# Altium schematic sheet LCD&SDcard.SchDoc: LCD & SD Card
size A4; Date: Not used; ApprovedBy: Not used; CheckedBy: Not used; Author: Not used; CompanyName: STMicroelectronics; DrawnBy: Not used; Engineer: Not used; Organization: Not used; Address1: Not used; Address2: Not used; Address3: Not used; Address4: Not used; DocumentNumber: Not used; Revision: Not used; SheetNumber: 10; SheetTotal: 22; CurrentTime: Not used; CurrentDate: Not used; Time: Not used; DocumentFullPathAndName: Not used; DocumentName: Not used; ModifiedDate: Not used; ImagePath: Not used; ProjectName: Not used; Application_BuildNumber: Not used
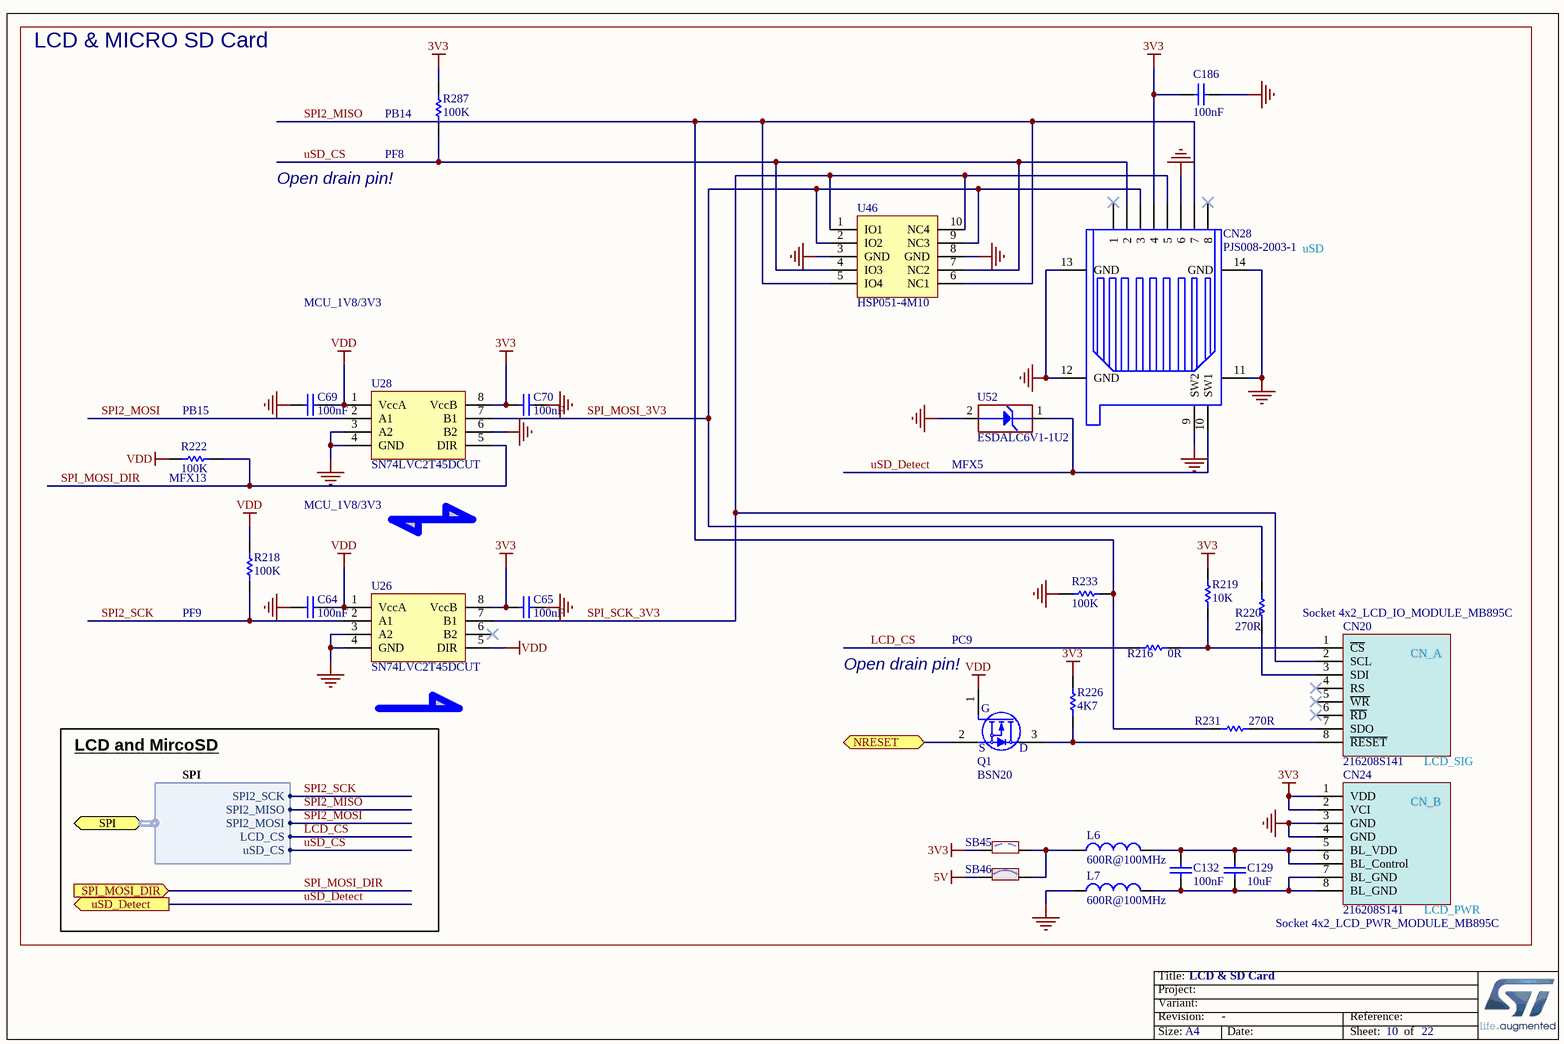
[diagram p0: LCD&SDcard.SchDoc]

## Parts
C64  value 100nF  [C0603]  (hidden comment: Capacitor)
C65  value 100nF  [C0603]  (hidden comment: Capacitor)
C69  value 100nF  [C0603]  (hidden comment: Capacitor)
C70  value 100nF  [C0603]  (hidden comment: Capacitor)
C129  value 10uF  [C0805]  (hidden comment: Capacitor)
C132  value 100nF  [C0402]  (hidden comment: Capacitor)
C186  value 100nF  [C0402]  (hidden comment: Capacitor)
CN20  Socket 4x2_LCD_IO_MODULE_MB895C  value 216208S141  [CON_SOCKET-LCD_LYCN_216208S141]
CN24  Socket 4x2_LCD_PWR_MODULE_MB895C  value 216208S141  [CON_SOCKET-LCD_LYCN_216208S141]
CN28  value PJS008-2003-1  [CON_MICROSD_YAMAICHI_PJS008-2003-1]  (hidden comment: microSD-PJS008-2003)
L6  value 600R@100MHz  [L0603]  (hidden comment: BEAD)
L7  value 600R@100MHz  [L0603]  (hidden comment: BEAD)
Q1  BSN20  [MOS_SOT23]
R216  value 0R  [R0603]  (hidden comment: Resistor)
R218  value 100K  [R0603]  (hidden comment: Resistor)
R219  value 10K  [R0603]  (hidden comment: Resistor)
R220  value 270R  [R0603]  (hidden comment: Resistor)
R222  value 100K  [R0603]  (hidden comment: Resistor)
R226  value 4K7  [R0402]  (hidden comment: Resistor)
R231  value 270R  [R0603]  (hidden comment: Resistor)
R233  value 100K  [R0603]  (hidden comment: Resistor)
R287  value 100K  [R0603]  (hidden comment: Resistor)
SB45  SB_OFF  [SOLDER-BRIDGE_R0603-0R]  (value not drawn)
SB46  SB_ON  [SOLDER-BRIDGE_R0603-0R]  (value not drawn)
U26  SN74LVC2T45DCUT  [ICC_VSSOP8_DCU_R-PDSO-G8_2X2P30_P050]
U28  SN74LVC2T45DCUT  [ICC_VSSOP8_DCU_R-PDSO-G8_2X2P30_P050]
U46  HSP051-4M10  [ESD_UQFN-10L_2P5X1_P050]
U52  value ESDALC6V1-1U2  [ESD_ST0201]  (hidden comment: ESD-TRANSIL)

## Ports
NRESET, SPI (harness SPI), SPI_MOSI_DIR (in), uSD_Detect (out)

## Harnesses
SPI: SPI2_SCK, SPI2_MISO, SPI2_MOSI, LCD_CS, uSD_CS

## Nets
3V3: C65.2 C70.2 C186.1 CN24.1(VDD) CN24.2(VCI) CN28.4 R219.2 R226.1 R287.2 SB45.1 U26.8(VccB) U28.8(VccB)
5V: SB46.1
GND: C64.2 C65.1 C69.2 C70.1 C186.2 CN24.3(GND) CN24.4(GND) CN28.6 CN28.9(SW2) CN28.11(GND) CN28.12(GND) CN28.13(GND) CN28.14(GND) L7.1 R233.2 U26.3(A2) U26.4(GND) U28.3(A2) U28.4(GND) U28.6(B2) U46.3(GND) U46.8(GND) U52.2(GND)
VDD: C64.1 C69.1 Q1.1(G) R218.2 R222.2 U26.1(VccA) U26.5(DIR) U28.1(VccA)
LCD_CS: R216.1 ; port SPI.LCD_CS
NRESET: Q1.2(S) ; port NRESET
SPI2_MISO: CN28.7 R231.1 R233.1 U46.5(IO4) U46.6(NC1) ; port SPI.SPI2_MISO
SPI2_MOSI: U28.2(A1) ; port SPI.SPI2_MOSI
SPI2_SCK: R218.1 U26.2(A1) ; port SPI.SPI2_SCK
SPI_MOSI_3V3: CN28.3 R220.1 U28.7(B1) U46.2(IO2) U46.9(NC3)
SPI_MOSI_DIR: R222.1 U28.5(DIR) ; port SPI_MOSI_DIR
SPI_SCK_3V3: CN20.2(SCL) CN28.5 U26.7(B1) U46.1(IO1) U46.10(NC4)
uSD_CS: CN28.2 R287.1 U46.4(IO3) U46.7(NC2) ; port SPI.uSD_CS
uSD_Detect: CN28.10(SW1) U52.1(IO1) ; port uSD_Detect
NetC129_1: C129.1 C132.2 CN24.5(BL_VDD) CN24.6(BL_Control) L6.2
NetC129_2: C129.2 C132.1 CN24.7(BL_GND) CN24.8(BL_GND) L7.2
NetCN20_1: CN20.1(~{CS}) R216.2 R219.1
NetCN20_3: CN20.3(SDI) R220.2
NetCN20_7: CN20.7(SDO) R231.2
NetCN20_8: CN20.8(~{RESET}) Q1.3(D) R226.2
NetL6_1: L6.1 SB45.2 SB46.2

Not connected (* = marked no-connect by the designer): CN20 4(RS)* 5(~{WR})* 6(~{RD})*; CN28 1* 8*; U26 6(B2)*

## Notes on the sheet
- LCD & MICRO SD Card
- (near R287) PB14
- Open drain pin!
- (near R287) PF8
- uSD
- MCU_1V8/3V3
- (near R222) PB15
- (near R222) MFX13
- (near U52) MFX5
- PF9
- PC9
- (near Q1) Open drain pin!
- LCD and MircoSD
- LCD_SIG
- LCD_PWR
- Title:
- Project:
- Size:
- Revision:
- Variant:
- A4
- -
- Date:
- Reference:
- Sheet:
- of
- (in symbol MCD-01174) CN_A
- (in symbol MCD-01195) CN_B

## Library data of the parts
C64 C65 C69 C70 = MCD-00211: Capacitor, MLCC, 100nF, 16V, X7R, 10%, 0603, T=0,8mm; Manufacturer_Part_Number: CC0603KRX7R7BB104; Manufacturer: YAGEO; Provided_By: SUBCO; Initial_Board_Reference: MB1319; Path: ws/MCD_ApplicationBoards/Lists/MCDPARTSdatabase; Item Type: Item; Internal_Part_Number: MCD-00211; ComponentLink1Description: Datasheet; Status: Released; Part_Type: Capacitor; Package: C0603; ComponentLink1URL: http://tunmcdsvn.tun.st.com/Component_Datasheet_Library/Trunk/Capacitors/Yageo_Multilayer_Capacitor_X7R_series_100pF_to_22uF
C129 = MCD-00014: Capacitor, MLCC, 10uF, 25V, X5R, 10%, 0805, T=0,85mm; Manufacturer_Part_Number: CC0805KRX5R8BB106; Manufacturer: YAGEO; Provided_By: SUBCO; Initial_Board_Reference: MB1274; Path: ws/MCD_ApplicationBoards/Lists/MCDPARTSdatabase; Item Type: Item; Internal_Part_Number: MCD-00014; Status: Released; Part_Type: Capacitor; Package: C0805; ComponentLink1Description: Datasheet; ComponentLink1URL: http://tunmcdsvn.tun.st.com/Component_Datasheet_Library/Trunk/Capacitors/Yageo_Multilayer_capacitor_X5R_series_100pF_to_100uF
C132 C186 = MCD-00006: Capacitor, MLCC, 100nF, 16V, X7R, 10%, 0402, T=0.5mm; Manufacturer_Part_Number: CC0402KRX7R7BB104; Manufacturer: YAGEO; Alternate_Manufacturer_Part_Number: GCM155R71C104KA55D; Alternate_Manufacturer: MURATA; Provided_By: SUBCO; Initial_Board_Reference: MB1274; Path: ws/MCD_ApplicationBoards/Lists/MCDPARTSdatabase; Item Type: Item; Internal_Part_Number: MCD-00006; Status: Released; Part_Type: Capacitor; Package: C0402; ComponentLink1Description: Datasheet; ComponentLink1URL: http://tunmcdsvn.tun.st.com/Component_Datasheet_Library/Trunk/Capacitors/Yageo_Multilayer_Capacitor_X7R_series_100pF_to_22uF
CN20 = MCD-01174: Socket, 4x2, 2.54mm, VR, TH, Height 6.8mm, Double row; Part_Type: Connector; Manufacturer: LYCN; Provided_By: SUBCO; Initial_Board_Reference: MB1397; Path: ws/MCD_ApplicationBoards/Lists/MCDPARTSdatabase; Item Type: Item; Internal_Part_Number: MCD-01174; Status: Checked; Manufacturer_Part_Number: 216208S141; ComponentLink1Description: Datasheet; ComponentLink1URL: http://tunmcdsvn.tun.st.com/Component_Datasheet_Library/Trunk/Connectors/LYCN_216208S141
CN24 = MCD-01195: socket, 4x2, 2.54mm, VR, TH, Height 6.8mm, Double row; Part_Type: Connector; Manufacturer: LYCN; Provided_By: SUBCO; Initial_Board_Reference: MB1397; Remark: same footprint as MCD-01174; Path: ws/MCD_ApplicationBoards/Lists/MCDPARTSdatabase; Item Type: Item; Internal_Part_Number: MCD-01195; Status: Checked; Manufacturer_Part_Number: 216208S141; ComponentLink1Description: Datasheet; ComponentLink1URL: http://tunmcdsvn.tun.st.com/Component_Datasheet_Library/Trunk/Connectors/LYCN_216208S141
CN28 = MCD-00023: MicroSD Card Conn, Reversed-Type, Mnt Push-Push, Positionning holes; Manufacturer: YAMAICHI; Part_Type: Connector; Provided_By: SUBCO; Initial_Board_Reference: MB1274; Path: ws/MCD_ApplicationBoards/Lists/MCDPARTSdatabase; Item Type: Item; Internal_Part_Number: MCD-00023; Manufacturer_Part_Number: PJS008-2003-1; ComponentLink1Description: Datasheet; Status: Released; ComponentLink1URL: http://tunmcdsvn.tun.st.com/Component_Datasheet_Library/Trunk/Connectors/Yamaichi_Connector_microSD-Card-PJS008-2003
L6 L7 = MCD-00047: SMD Chip ferrite bead, 600R@100MHz +/-25%, 350mA, 500mohm DC, 0603, T=0.8mm; Part_Type: Inductor; Manufacturer_Part_Number: FCM1608KF-601T03; Manufacturer: TAI-TECH; Provided_By: SUBCO; Initial_Board_Reference: MB1274; Path: ws/MCD_ApplicationBoards/Lists/MCDPARTSdatabase; Item Type: Item; Internal_Part_Number: MCD-00047; Status: Released; ComponentLink1Description: Datasheet; ComponentLink1URL: http://tunmcdsvn.tun.st.com/Component_Datasheet_Library/Trunk/Inductors/TaiTech_Bead_FCM1608_series
Q1 = MCD-00151: N-channel enhancement mode field-effect transistor; Part_Type: IC; Manufacturer: NXP; Provided_By: SUBCO; Initial_Board_Reference: MB1262; Path: ws/MCD_ApplicationBoards/Lists/MCDPARTSdatabase; Item Type: Item; Internal_Part_Number: MCD-00151; Value: BSN20; Status: Released; Manufacturer_Part_Number: BSN20; ComponentLink1Description: Datasheet; ComponentLink1URL: http://tunmcdsvn.tun.st.com/Component_Datasheet_Library/Trunk/IC/NXP_Transistor_BSN20BK_SOT23
R216 = MCD-00056: Resistor,0R,0603,5%,1/10W; Manufacturer_Part_Number: RC0603JR-070RL; Manufacturer: YAGEO; Provided_By: SUBCO; Initial_Board_Reference: MB1274; Path: ws/MCD_ApplicationBoards/Lists/MCDPARTSdatabase; Item Type: Item; Internal_Part_Number: MCD-00056; Status: Released; Part_Type: Resistor; Package: R0603; ComponentLink1Description: Datasheet; ComponentLink1URL: http://tunmcdsvn.tun.st.com/Component_Datasheet_Library/Trunk/Resistors/Yageo_Resistor_RC0603-series
R218 R222 R233 R287 = MCD-00223: Resistor,100K,0603,1%,1/10W; Manufacturer_Part_Number: RC0603FR-07100KL; Manufacturer: YAGEO; Provided_By: SUBCO; Initial_Board_Reference: MB1319; Path: ws/MCD_ApplicationBoards/Lists/MCDPARTSdatabase; Item Type: Item; Internal_Part_Number: MCD-00223; Status: Released; Part_Type: Resistor; Package: R0603; ComponentLink1Description: Datasheet; ComponentLink1URL: http://tunmcdsvn.tun.st.com/Component_Datasheet_Library/Trunk/Resistors/Yageo_Resistor_RC0603-series
R219 = MCD-00220: Resistor,10K,0603,1%,1/10W; Manufacturer_Part_Number: RC0603FR-0710KL; Manufacturer: YAGEO; Provided_By: SUBCO; Initial_Board_Reference: MB1319; Path: ws/MCD_ApplicationBoards/Lists/MCDPARTSdatabase; Item Type: Item; Internal_Part_Number: MCD-00220; Status: Released; Part_Type: Resistor; Package: R0603; ComponentLink1Description: Datasheet; ComponentLink1URL: http://tunmcdsvn.tun.st.com/Component_Datasheet_Library/Trunk/Resistors/Yageo_Resistor_RC0603-series
R220 R231 = MCD-00442: Resistor,270R,0603,1%,1/10W; Manufacturer_Part_Number: RC0603FR-07270RL; Manufacturer: YAGEO; Provided_By: SUBCO; Initial_Board_Reference: MBxxxx; Path: ws/MCD_ApplicationBoards/Lists/MCDPARTSdatabase; Item Type: Item; Internal_Part_Number: MCD-00442; Status: Released; Part_Type: Resistor; Package: R0603; ComponentLink1Description: Datasheet; ComponentLink1URL: http://tunmcdsvn.tun.st.com/Component_Datasheet_Library/Trunk/Resistors/Yageo_Resistor_RC0603-series
R226 = MCD-00065: Resistor,4K7,0402,1%,1/16W; Manufacturer_Part_Number: RC0402FR-074K7L; Manufacturer: YAGEO; Alternate_Manufacturer_Part_Number: RT0402FRE074K7L; Provided_By: SUBCO; Initial_Board_Reference: MB1274; Path: ws/MCD_ApplicationBoards/Lists/MCDPARTSdatabase; Item Type: Item; Internal_Part_Number: MCD-00065; Status: Released; Part_Type: Resistor; Package: R0402; ComponentLink1Description: Datasheet; ComponentLink1URL: http://tunmcdsvn.tun.st.com/Component_Datasheet_Library/Trunk/Resistors/Yageo_Resistor_RC0402-series; Alternate_Manufacturer: YAGEO
SB45 = MCD-00072: Solder Bridge OFF; Part_Type: Mechanical; Manufacturer_Part_Number: RC0603JR-070RL; Manufacturer: YAGEO; Provided_By: SUBCO; Initial_Board_Reference: MB1274; Path: ws/MCD_ApplicationBoards/Lists/MCDPARTSdatabase; Item Type: Item; Internal_Part_Number: MCD-00072; Status: Released; ComponentLink1Description: Datasheet; Package: SB0603; ComponentLink1URL: http://tunmcdsvn.tun.st.com/Component_Datasheet_Library/Trunk/Resistors/Yageo_Resistor_RC0603-series
SB46 = MCD-00071: Solder Bridge ON; Part_Type: Mechanical; Manufacturer_Part_Number: RC0603JR-070RL; Manufacturer: YAGEO; Provided_By: SUBCO; Initial_Board_Reference: MB1274; Path: ws/MCD_ApplicationBoards/Lists/MCDPARTSdatabase; Item Type: Item; Internal_Part_Number: MCD-00071; Status: Released; ComponentLink1Description: Datasheet; Package: SB0603; ComponentLink1URL: http://tunmcdsvn.tun.st.com/Component_Datasheet_Library/Trunk/Resistors/Yageo_Resistor_RC0603-series
U26 U28 = MCD-00264: Dual bit dual supply bus transceiver; Part_Type: IC; Manufacturer: TEXAS INSTRUMENTS; Provided_By: SUBCO; Initial_Board_Reference: MB1319; Path: ws/MCD_ApplicationBoards/Lists/MCDPARTSdatabase; Item Type: Item; Internal_Part_Number: MCD-00264; Value: SN74LVC2T45DCUT; Status: Released; Manufacturer_Part_Number: SN74LVC2T45DCUT; ComponentLink1Description: Datasheet; ComponentLink1URL: http://tunmcdsvn.tun.st.com/Component_Datasheet_Library/Trunk/IC/TI_Dual_bit_tranceiver_SN74LVC2T45
U46 = MCD-00667: 4-line ESD protection for high speed lines; Manufacturer: STMICROELECTRONICS; Part_Type: Diode; BMS_Part_Number: 9179041; Provided_By: SUBCO with ST control; Initial_Board_Reference: MB1331; Path: ws/MCD_ApplicationBoards/Lists/MCDPARTSdatabase; Item Type: Item; Manufacturer_Part_Number: HSP051-4M10; Internal_Part_Number: MCD-00667; Value: HSP051-4M10; Status: Checked; Package: uQFN-10L; ComponentLink1Description: Datasheet; ComponentLink1URL: http://tunmcdsvn.tun.st.com/Component_Datasheet_Library/Trunk/Diodes/STM_ESD_HSP051-4M10
U52 = MCD-00170: ESD protection 6V1; Part_Type: Diode; Manufacturer: STMICROELECTRONICS; BMS_Part_Number: 9151132; Provided_By: SUBCO with ST control; Initial_Board_Reference: MB1274; Path: ws/MCD_ApplicationBoards/Lists/MCDPARTSdatabase; Item Type: Item; Internal_Part_Number: MCD-00170; Status: Released; Manufacturer_Part_Number: ESDALC6V1-1U2; ComponentLink1Description: Datasheet; ComponentLink1URL: http://tunmcdsvn.tun.st.com/Component_Datasheet_Library/Trunk/Diodes/STM_ESD_ESDALC6V1-1U2